# Altium schematic sheet PCB_Study.SchDoc
size A4
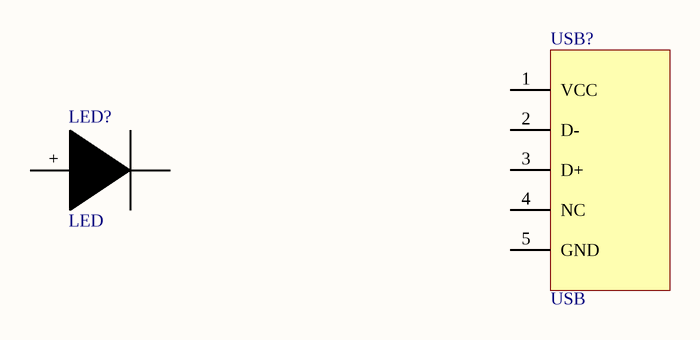
[diagram p0: PCB_Study.SchDoc]

## Parts
LED?  LED
USB?  USB

## Nets

Not connected (* = marked no-connect by the designer): LED? + -; USB? 1(VCC) 2(D-) 3(D+) 4(NC) 5(GND)

## Library data of the parts
USB? = MiniUSB